# EAGLE design rs485_interface (EAGLE 9.6.2)
COMPONENTS: RS485-Transceiver; DESCRIPTION: RS485-Interface-Board; DRAWING_VERSION: 1.0; DRAWN: Tobias Poppe; FIRMA: Tobias Poppe; PRINTDATE: 30.01.2023; PROJECT: Open-WaLeS; STATUS: Prod.
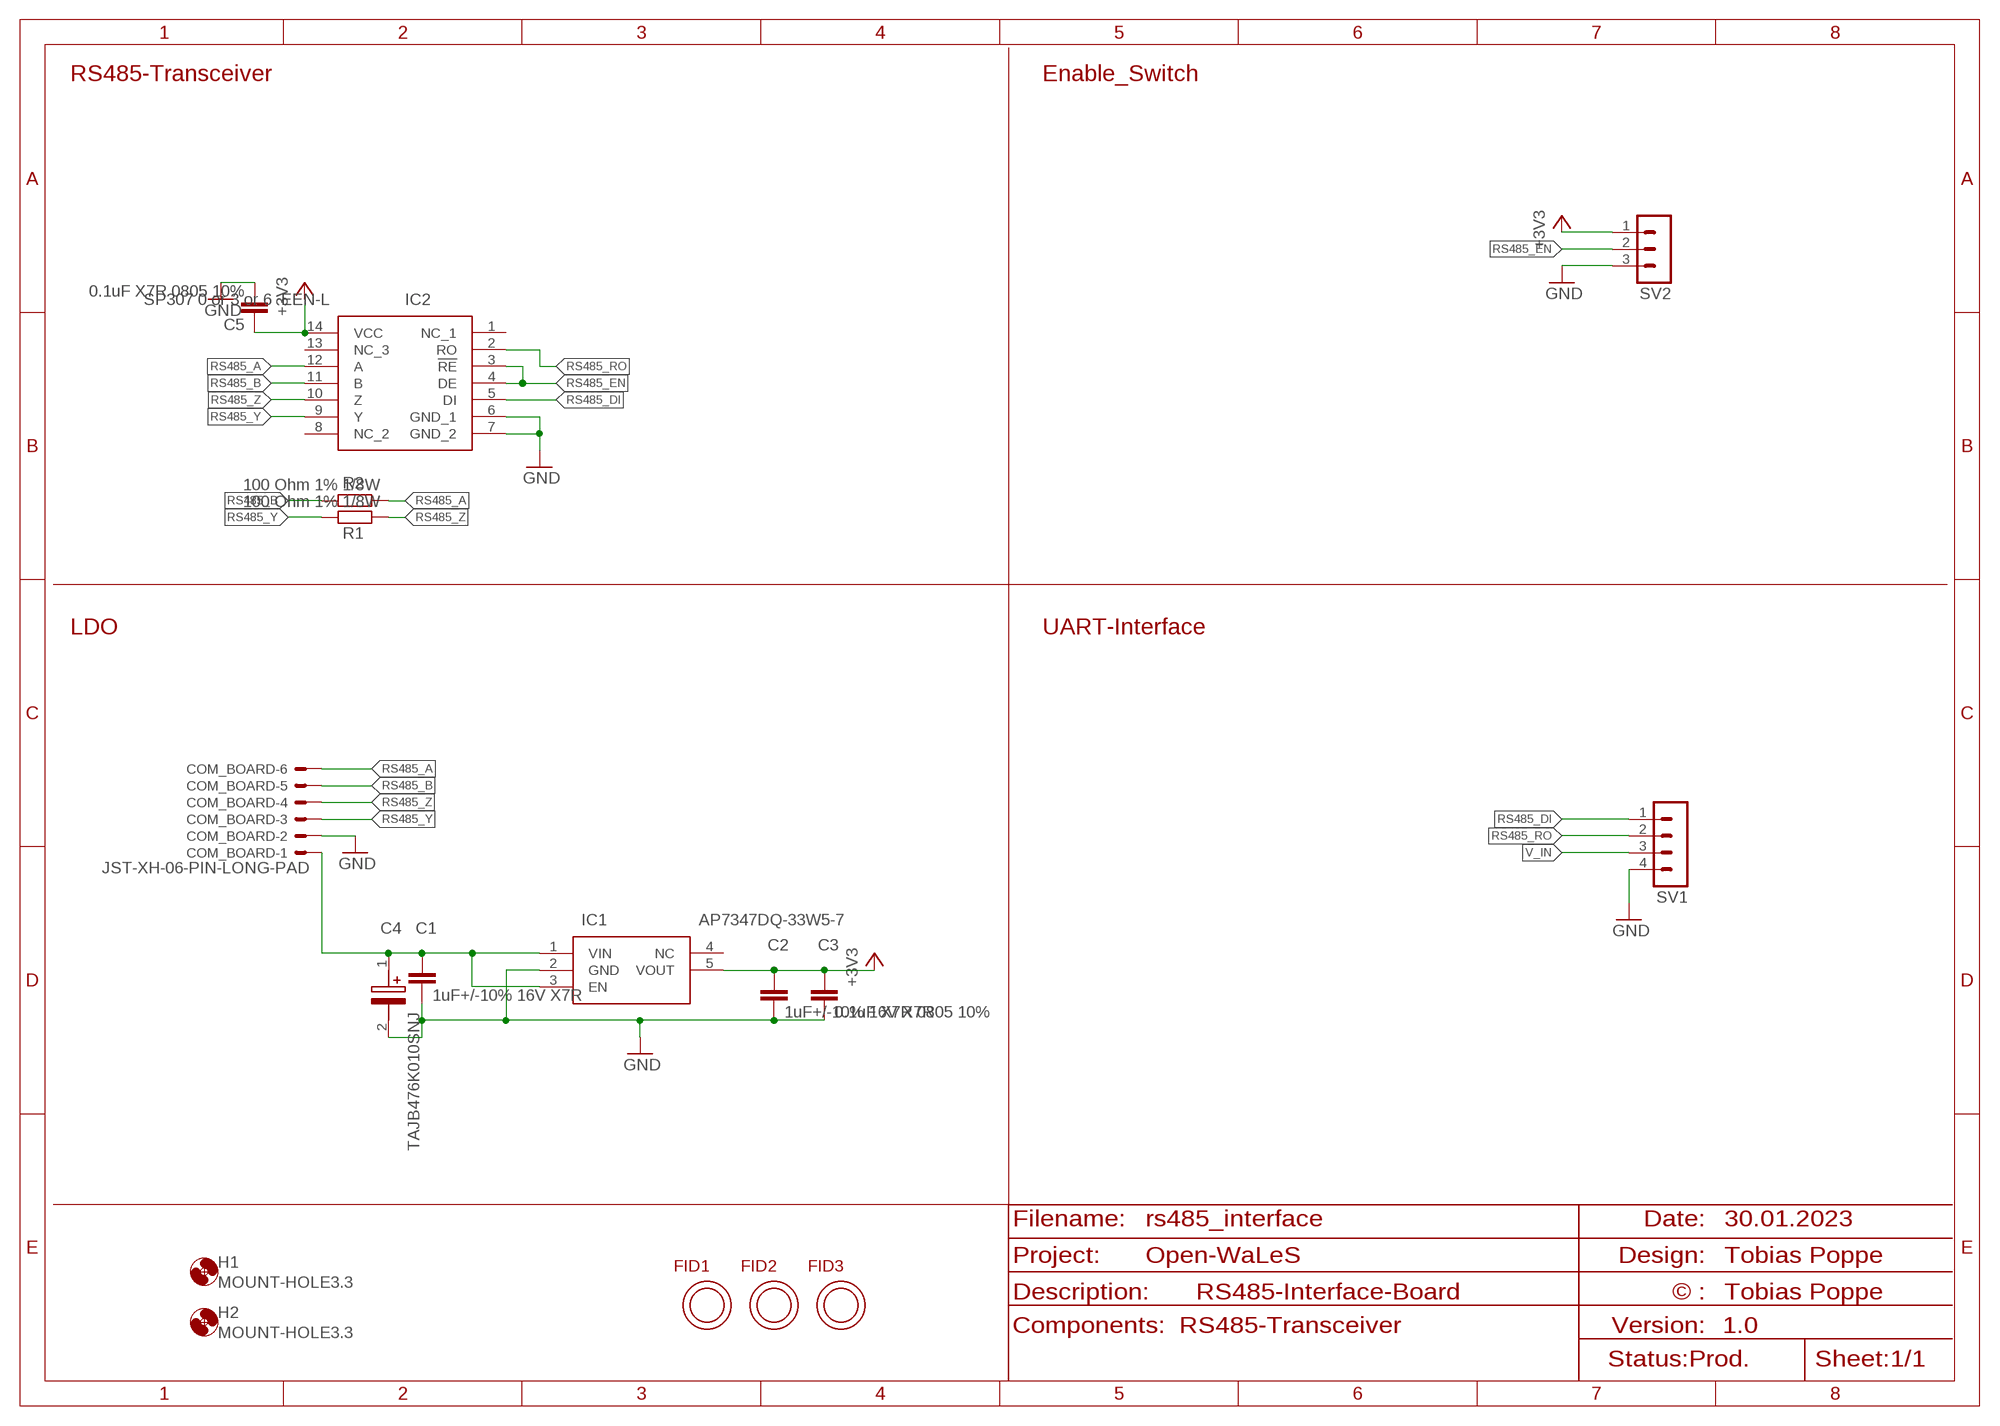
[diagram p0: schematic, sheet 1]

## Parts
C1  1uF+/-10% 16V X7R  C-EUC0805  [C0805]
C2  1uF+/-10% 16V X7R  C-EUC0805  [C0805]
C3  0.1uF X7R 0805 10%  C-EUC0805  [C0805]
C4  TAJB476K010SNJ  [CAPPM3528X210N]
C5  0.1uF X7R 0805 10%  C-EUC0805  [C0805]
COM_BOARD  JST-XH-06-PIN-LONG-PAD  [JST-XH-06-PACKAGE-LONG-PAD]
FID1  OPEN-PNP-FIDUCIAL  [OPEN-PNP-FIDUCIAL]
FID2  OPEN-PNP-FIDUCIAL  [OPEN-PNP-FIDUCIAL]
FID3  OPEN-PNP-FIDUCIAL  [OPEN-PNP-FIDUCIAL]
H1  MOUNT-HOLE3.3  [3,3]
H2  MOUNT-HOLE3.3  [3,3]
IC1  AP7347DQ-33W5-7  [SOT95P280X145-5N]
IC2  SP307 0 or 3 or 6 EEN-L  SP3076EEN-L  [SOIC127P600X175-14N]
R1  100 Ohm 1% 1/8W  R-EU_R0805  [R0805]
R2  100 Ohm 1% 1/8W  R-EU_R0805  [R0805]
SV1  MA04-1  [MA04-1]
SV2  MA03-1  [MA03-1]

## Nets
+3V3: C2.1 C3.1 C5.1 IC1.5(VOUT) IC2.14(VCC) SV2.1
GND: C1.2 C2.2 C3.2 C4.2(-) C5.2 COM_BOARD.2 IC1.2(GND) IC2.6(GND_1) IC2.7(GND_2) SV1.4 SV2.3
RS485_A: COM_BOARD.6 IC2.12(A) R2.1
RS485_B: COM_BOARD.5 IC2.11(B) R2.2
RS485_DI: IC2.5(DI) SV1.1
RS485_EN: IC2.3(!RE) IC2.4(DE) SV2.2
RS485_RO: IC2.2(RO) SV1.2
RS485_Y: COM_BOARD.3 IC2.9(Y) R1.2
RS485_Z: COM_BOARD.4 IC2.10(Z) R1.1
V_IN: C1.1 C4.1(+) COM_BOARD.1 IC1.1(VIN) IC1.3(EN) SV1.3
Unconnected: IC1.4(NC) IC2.1(NC_1) IC2.8(NC_2) IC2.13(NC_3)

## Notes on the sheet
- RS485-Transceiver | Enable_Switch
- LDO | UART-Interface

## Library data of the parts
C1-C3 C5 = rcl:C-EU: CAPACITOR, European symbol; SPICEPREFIX: C
C4 = samacsys:TAJB476K010SNJ: Tantalum Capacitors - Solid SMD 10volts 47uF 10% Source: Datasheet <http://datasheets.avx.com/TAJ.pdf>; ARROW_PART_NUMBER: TAJB476K010SNJ; ARROW_PRICE-STOCK: https://www.arrow.com/en/products/tajb476k010snj/avx; DESCRIPTION: Tantalum Capacitors - Solid SMD 10volts 47uF 10%; HEIGHT: 2.1mm; MANUFACTURER_NAME: AVX; MANUFACTURER_PART_NUMBER: TAJB476K010SNJ; MOUSER_PART_NUMBER: 581-TAJB476K010SNJ; MOUSER_PRICE-STOCK: https://www.mouser.co.uk/ProductDetail/AVX/TAJB476K010SNJ?qs=ZkOCJBwOl244F5j46leeNA%3D%3D
COM_BOARD = Rembrandt Electronics - JST XH Connectors v1-0:JST-XH-06-PIN: JST XH Connector 2 Pin Wire to board connector. Pitch: 2,54 mm, (0.100") Number of pins: 6 Created by Rembrandt Electronics www.rembrandtelectronics.com
FID1-FID3 = topo-eng:OPEN-PNP-FIDUCIAL
H1 H2 = holes:MOUNT-HOLE: MOUNTING HOLE with drill center marker
IC1 = samacsys:AP7347DQ-33W5-7: LDO Voltage Regulators LDO CMOS LowCurr SOT25 T&R 3K Source: Datasheet <https://ad.componentsearchengine.com/partRequest.html?fs=0&partNumber=AP7347DQ-33W5-7&partID=15420390&lang=null&packageCategoryID=54&C=1&W=1>; DESCRIPTION: LDO Voltage Regulators LDO CMOS LowCurr SOT25 T&R 3K; HEIGHT: 1.45mm; MANUFACTURER_NAME: Diodes Inc.; MANUFACTURER_PART_NUMBER: AP7347DQ-33W5-7; MOUSER_PART_NUMBER: 621-AP7347DQ-33W5-7; MOUSER_PRICE-STOCK: https://www.mouser.co.uk/ProductDetail/Diodes-Incorporated/AP7347DQ-33W5-7?qs=XAiT9M5g4x%252B4DeOtxqD2uw%3D%3D
IC2 = samacsys:SP3076EEN-L: RS-422/RS-485 Interface IC RS485/RS422 Driver/ Receiver Transceiver Source: Datasheet <https://www.exar.com/content/document.ashx?id=1399>; DESCRIPTION: RS-422/RS-485 Interface IC RS485/RS422 Driver/ Receiver Transceiver; HEIGHT: 1.75mm; MANUFACTURER_NAME: MaxLinear, Inc.; MANUFACTURER_PART_NUMBER: SP3076EEN-L; MOUSER_PART_NUMBER: 701-SP3076EEN-L; MOUSER_PRICE-STOCK: https://www.mouser.co.uk/ProductDetail/MaxLinear/SP3076EEN-L?qs=H%252BP%2FcHWii3dfBcWqKh1L5g%3D%3D
R1 R2 = rcl:R-EU_: RESISTOR, European symbol; SPICEPREFIX: R
SV1 = con-lstb:MA04-1: PIN HEADER; OC_FARNELL: unknown; OC_NEWARK: unknown
SV2 = con-lstb:MA03-1: PIN HEADER; OC_FARNELL: unknown; OC_NEWARK: unknown

## Board
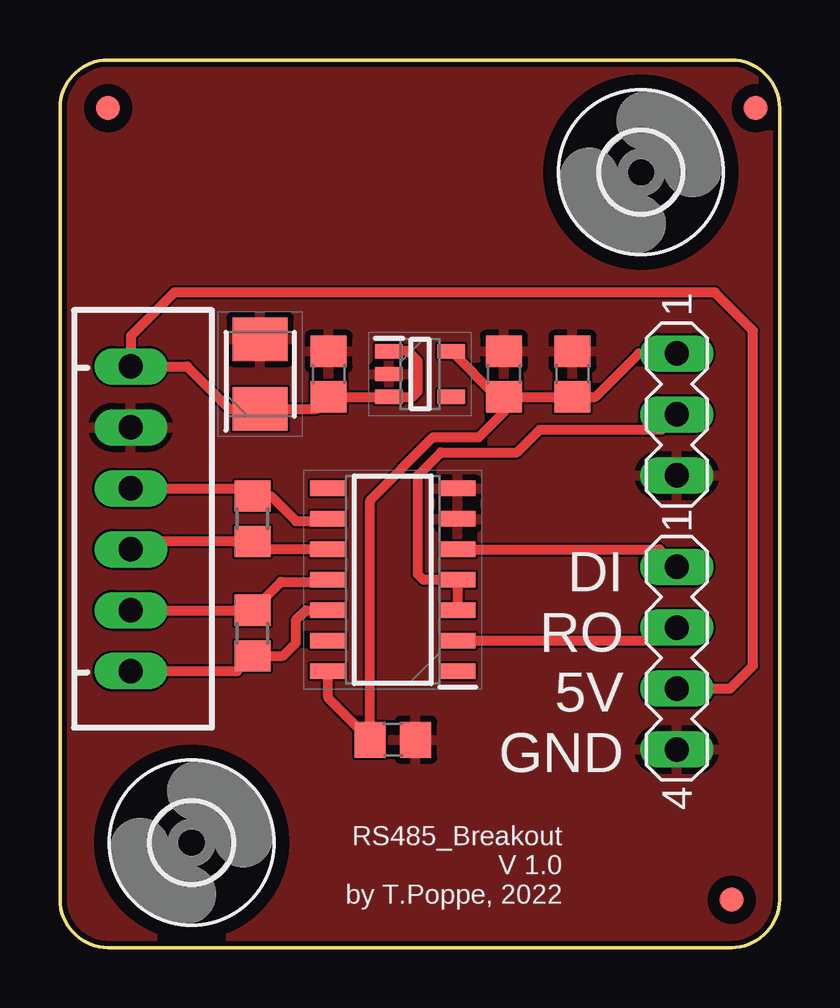
[diagram p1: board, top side]
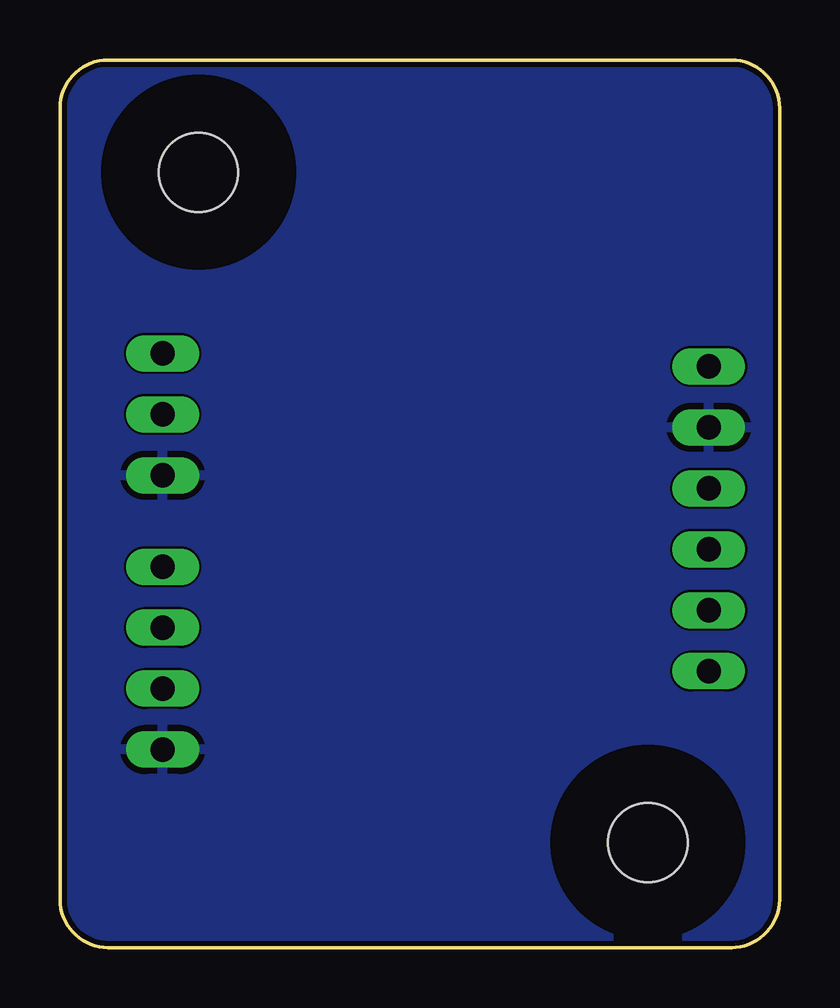
[diagram p2: board, bottom side, seen from below]

Size 30 x 37 mm. Coordinates in mm from the lower left corner, seen from the top.
Outline: 28,0 2,0 arc-90 0,2 0,35 arc-90 2,37 28,37 arc-90 30,35 30,2 arc-90 28,0
Copper layers (1*16): Top 0.035mm / dielectric 1.065mm / Bottom 0.035mm
Design rules "jlcpcb_4_layer *": minimum track width 3.5mil, minimum drill 0.2mm, track to track 3.5mil, track to pad 6mil, pad to pad 6mil, via to via 6mil, smd to smd 6mil, copper to edge 0.2mm, drill to drill 6mil, minimum pad ring 10mil, minimum via ring 8mil, stop-mask expansion 4mil, vias tented up to drill 0mil, thermal gap 10mil

### Footprints (pad centres in the part's own frame; a part is rotated, then mirrored left to right if it is on the bottom)
C0805 = smd 1.3 x 1.5: 1 -0.95,0; 2 0.95,0
CAPPM3528X210N = smd 1.8 x 2.3: 1 -1.45,0; 2 1.45,0
JST-XH-06-PACKAGE-LONG-PAD = drill 1.016 long: 1 -6.35,0; 2 -3.81,0; 3 -1.27,0; 4 1.27,0; 5 3.81,0; 6 6.35,0
OPEN-PNP-FIDUCIAL = smd 1 x 1: FID$1 0,0
3,3 = hole 3.3: 0,0
SOT95P280X145-5N = smd 1.15 x 0.6: 1 -1.3,0.95; 2 -1.3,0; 3 -1.3,-0.95; 4 1.3,-0.95; 5 1.3,0.95
SOIC127P600X175-14N = smd 1.5 x 0.65: 1 -2.7,3.81; 2 -2.7,2.54; 3 -2.7,1.27; 4 -2.7,0; 5 -2.7,-1.27; 6 -2.7,-2.54; 7 -2.7,-3.81; 8 2.7,-3.81; 9 2.7,-2.54; 10 2.7,-1.27; 11 2.7,0; 12 2.7,1.27; 13 2.7,2.54; 14 2.7,3.81
R0805 = smd 1.3 x 1.5: 1 -0.95,0; 2 0.95,0
MA04-1 = drill 1.016 long: 1 -3.81,0; 2 -1.27,0; 3 1.27,0; 4 3.81,0
MA03-1 = drill 1.016 long: 1 -2.54,0; 2 0,0; 3 2.54,0

### Placement (x,y rotation side)
C1  11.21,23.91 90 top
C2  18.51,23.91 90 top
C3  21.36,23.91 90 top
C4  8.35,23.91 90 top
C5  13.88,8.66 0 top
COM_BOARD  2.95,17.87 270 top
FID1  2,35 0 top
FID2  28,2 0 top
FID3  29,35 0 top
H1  5.49,4.38 0 top
H2  24.22,32.32 0 top
IC1  15.02,23.91 0 top
IC2  13.88,15.33 180 top
R1  8.03,17.87 90 top
R2  8.03,13.11 90 top
SV1  25.72,12.06 270 top
SV2  25.72,22.23 270 top

### Tracks (layer width: path | path; a pad name or v marks a point on that pad's centre or on a via)
+3V3
  Top 0.406: IC1.5 18.21,22.95 C2.1 | C2.1 C3.1 22.32,22.95 24.13,24.77 SV2.1 | IC2.14 11.18,10.41 C5.1 12.93,18.64 15.56,21.27 17.46,21.27 18.51,22.32 C2.1
GND
  pour Top: 30.66,-0.32 30.66,37.33 0,37.33 0,-0.32
  pour Bottom: 30.66,37.33 30.66,-0.32 0,-0.32 0,37.33
RS485_A
  Top 0.406: COM_BOARD.6 7.39,11.52 R2.1 9.3,12.16 9.84,12.7 9.84,13.65 10.25,14.06 IC2.12
RS485_B
  Top 0.406: COM_BOARD.5 R2.2 9.21,15.24 11.09,15.24 IC2.11
RS485_DI
  Top 0.406: IC2.5 24.99,16.6 SV1.1
RS485_EN
  Top 0.406: SV2.2 25.08,21.59 20,21.59 19.05,20.64 15.88,20.64 14.92,19.68 14.92,15.56 15.15,15.33 IC2.4 IC2.3
RS485_RO
  Top 0.406: IC2.2 25.18,12.79 SV1.2
RS485_Y
  Top 0.406: COM_BOARD.3 7.71,19.14 R1.2 8.8,18.82 9.84,17.78 11.09,17.78 IC2.9
RS485_Z
  Top 0.406: IC2.10 8.35,16.6 R1.1 3.27,16.92 COM_BOARD.4
V_IN
  Top 0.406: IC1.1 14.52,24.86 14.92,24.45 14.92,23.18 14.7,22.95 IC1.3 C1.1 10.71,22.45 C4.1 7.07,22.45 5.3,24.22 COM_BOARD.1 2.95,25.49 4.76,27.3 27.3,27.3 28.89,25.72 28.89,11.75 27.94,10.79 SV1.3

### Text on the board
tNames: DI / RO / 5V / GND | RS485_Breakout / V 1.0 / by T.Poppe, 2022